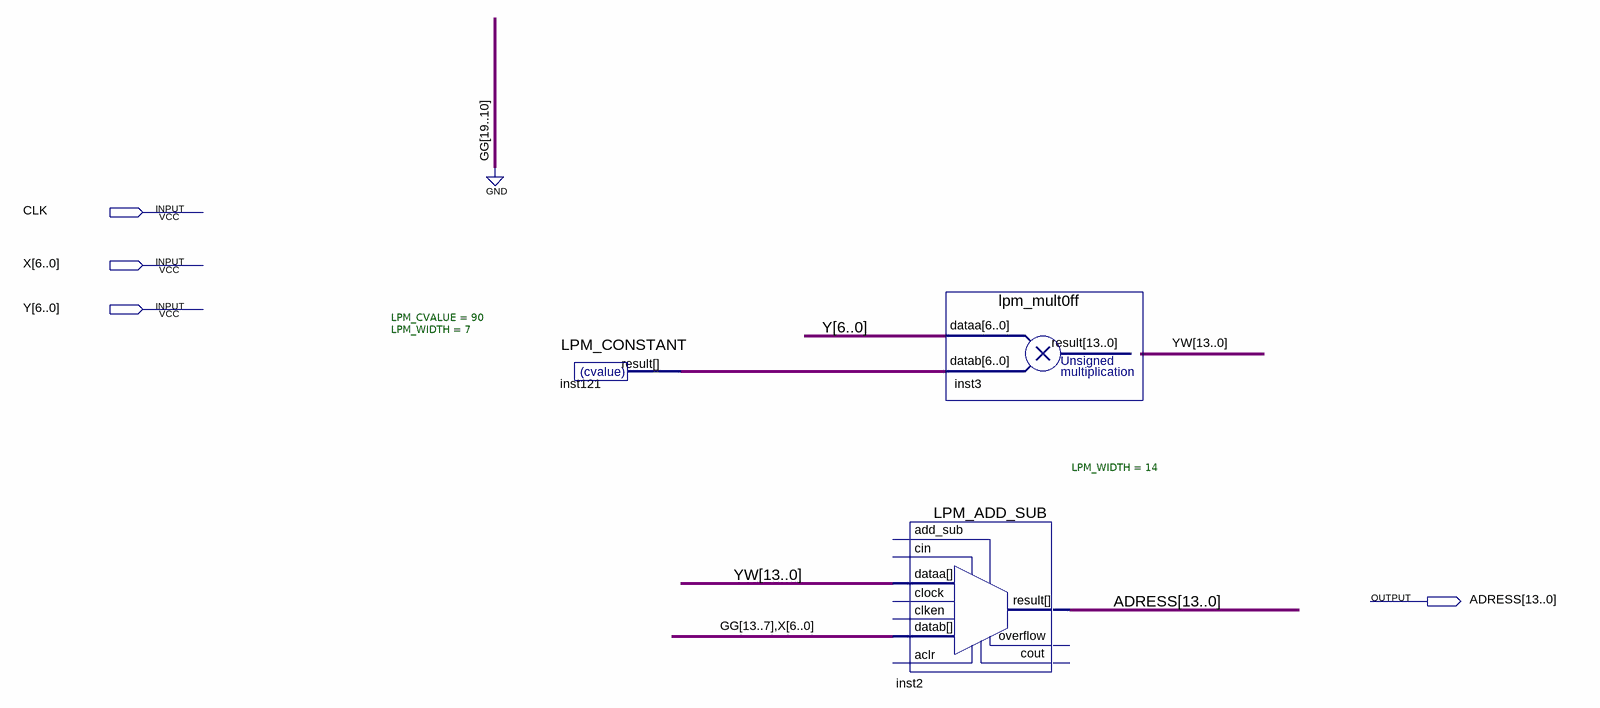
[diagram p0: schematic sheet]
// Quartus schematic LINE-ADR-bmp.bdf as structural Verilog: 3 symbols, 4 pins
module \LINE-ADR-bmp  (
  input  CLK,
  input  [6:0] X,
  input  [6:0] Y,
  output [13:0] ADRESS
);

  wire [6:0] inst121_result;
  wire [9:7] GG;
  wire [13:0] YW;

  LPM_CONSTANT #(.LPM_CVALUE(90), .LPM_WIDTH(7)) inst121 (.result(inst121_result));
  LPM_ADD_SUB #(.LPM_WIDTH(14)) inst2 (
    .datab({4'b0000, GG, X}), .dataa(YW), .result(ADRESS));  // open: add_sub, cin, aclr, clock, clken, cout, overflow
  lpm_mult0ff inst3 (.dataa(Y), .datab(inst121_result), .result(YW));
endmodule
